# Altium schematic sheet JTAG.SchDoc
size Tabloid; SheetNumber: 7; SheetTotal: 25; Sheet_Name: JTAG; Size: 11x17
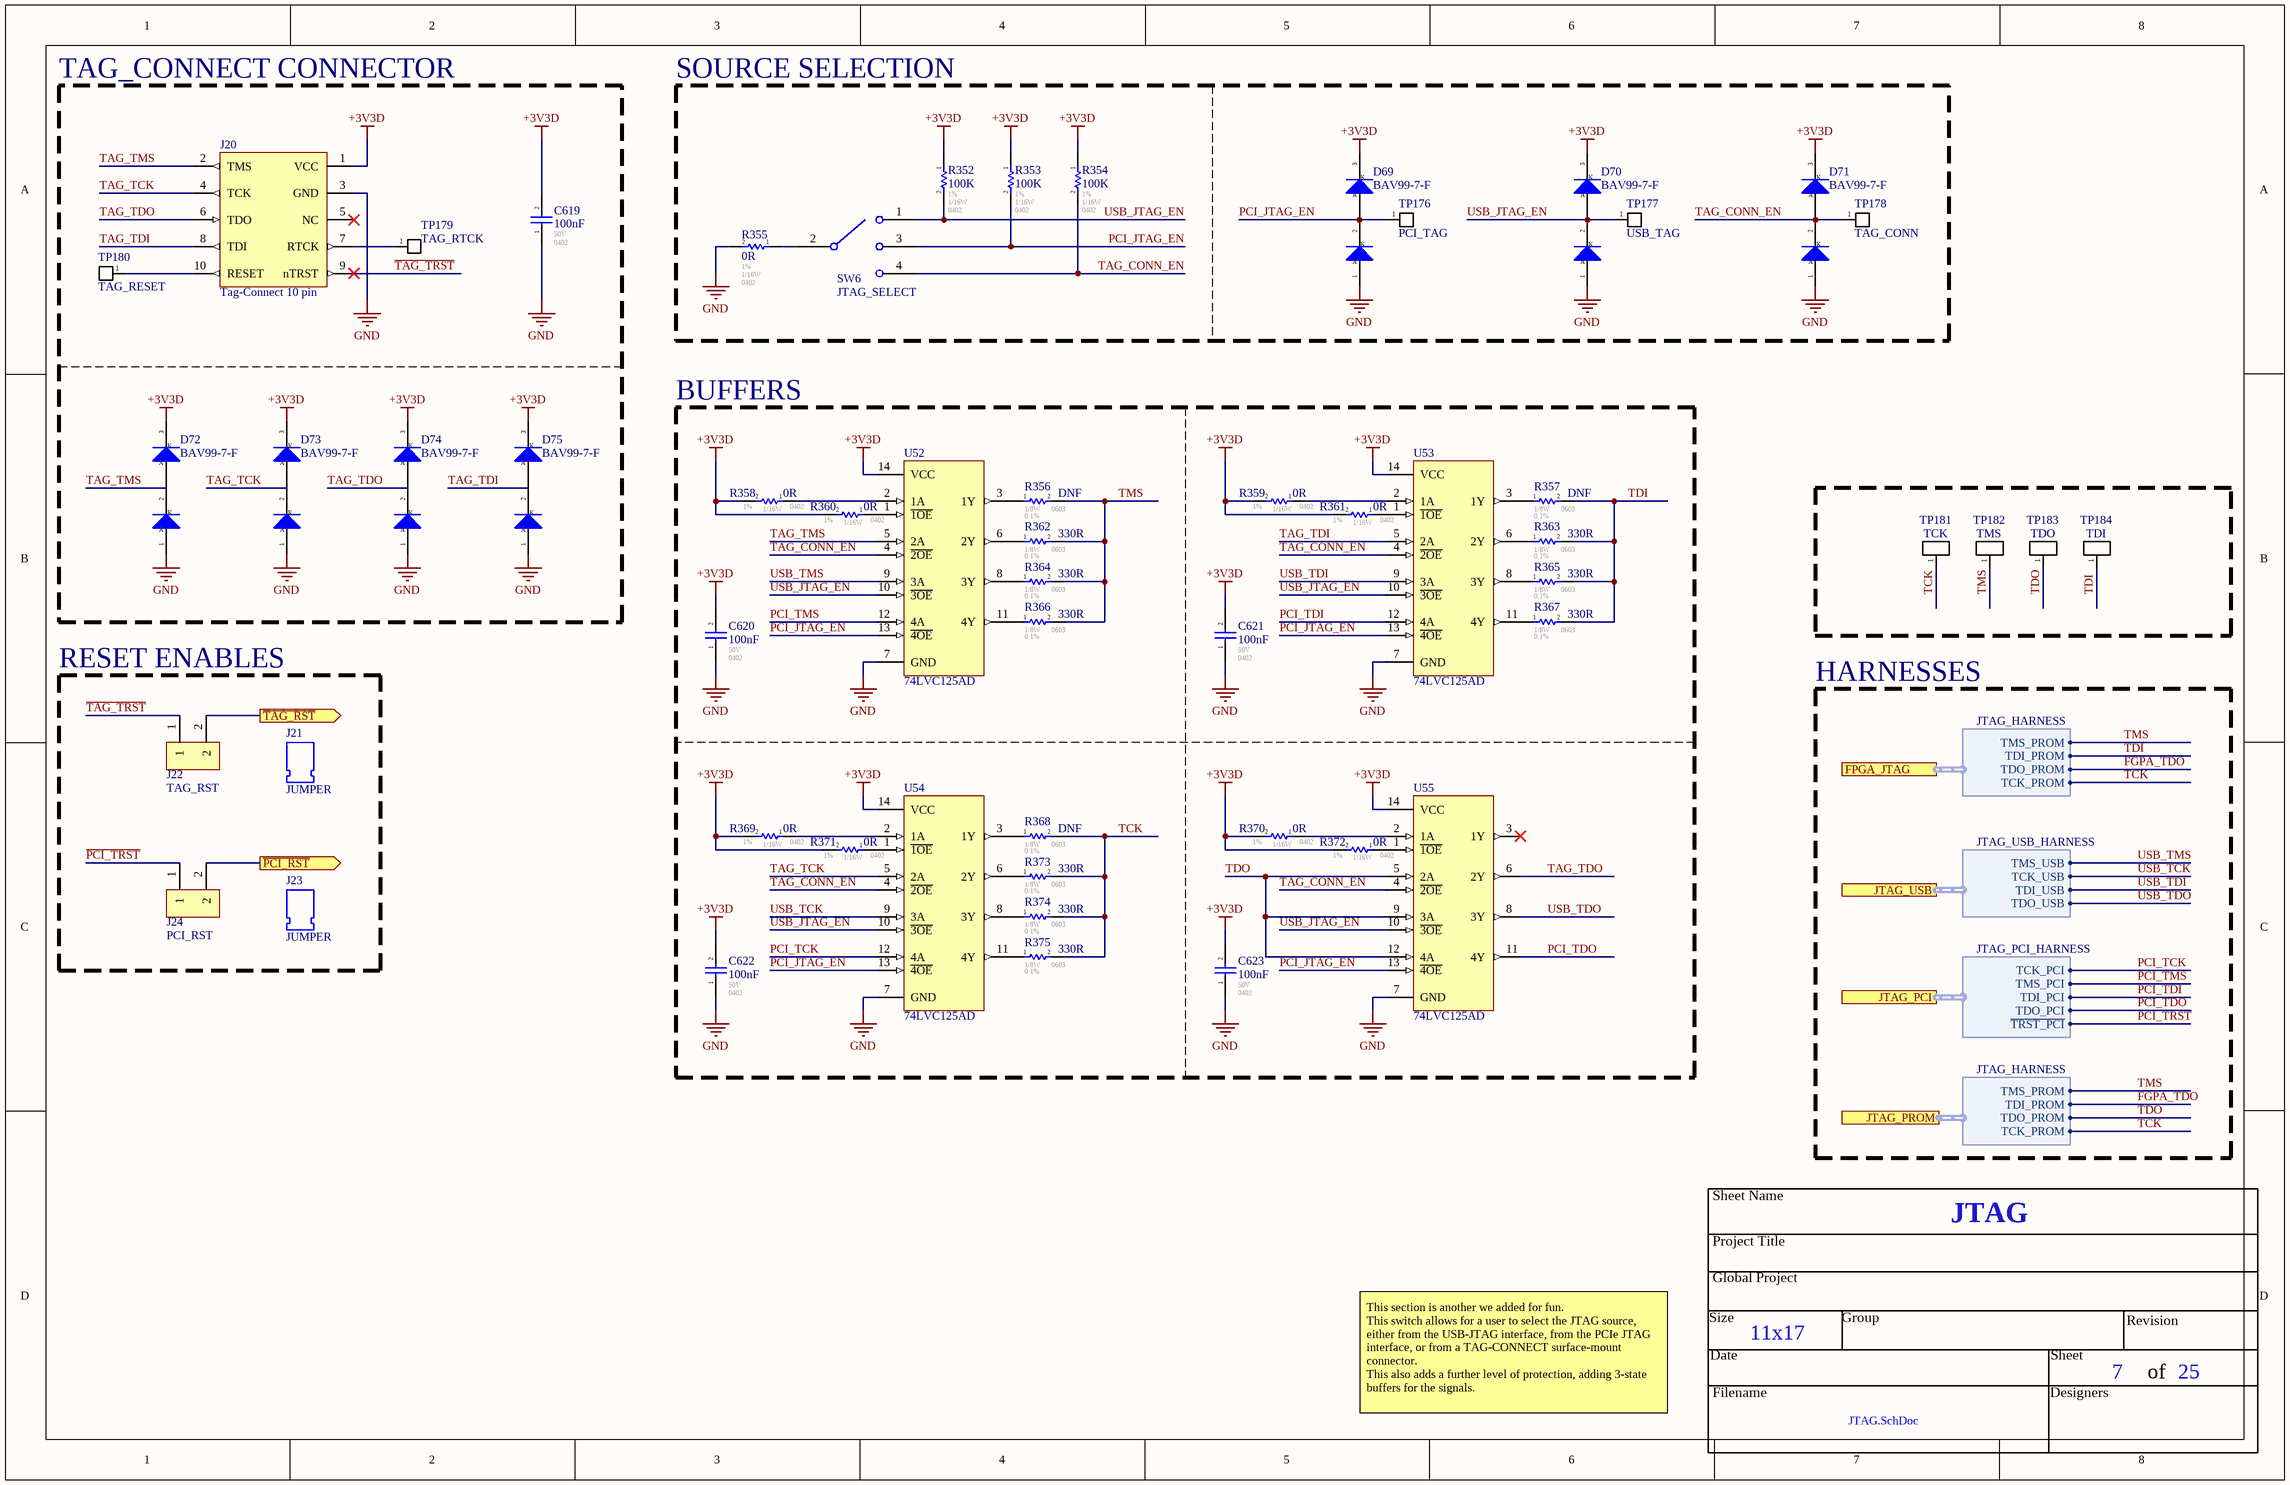
[diagram p0: JTAG.SchDoc]

## Parts
C619  100nF  Voltage - Rated: 50V  Footprint: 0402  [CAP_0402]
C620  100nF  Voltage - Rated: 50V  Footprint: 0402  [CAP_0402]
C621  100nF  Voltage - Rated: 50V  Footprint: 0402  [CAP_0402]
C622  100nF  Voltage - Rated: 50V  Footprint: 0402  [CAP_0402]
C623  100nF  Voltage - Rated: 50V  Footprint: 0402  [CAP_0402]
D69  BAV99-7-F  [SOT23-3]
D70  BAV99-7-F  [SOT23-3]
D71  BAV99-7-F  [SOT23-3]
D72  BAV99-7-F  [SOT23-3]
D73  BAV99-7-F  [SOT23-3]
D74  BAV99-7-F  [SOT23-3]
D75  BAV99-7-F  [SOT23-3]
J20  Tag-Connect 10 pin  [TC2050-NL]
J21  JUMPER  (mechanical)
J22  TAG_RST  [HEADER-2_100MIL]
J23  JUMPER  (mechanical)
J24  PCI_RST  [HEADER-2_100MIL]
R352  100K  Tolerance: 1%  Power: 1/16W  Package / Case: 0402  [RES_0402]
R353  100K  Tolerance: 1%  Power: 1/16W  Package / Case: 0402  [RES_0402]
R354  100K  Tolerance: 1%  Power: 1/16W  Package / Case: 0402  [RES_0402]
R355  0R  Tolerance: 1%  Power: 1/16W  Package / Case: 0402  [RES_0402]
R356  DNF  Tolerance: 0.1%  Power: 1/8W  Package / Case: 0603  [RES_0603]
R357  DNF  Tolerance: 0.1%  Power: 1/8W  Package / Case: 0603  [RES_0603]
R358  0R  Tolerance: 1%  Power: 1/16W  Package / Case: 0402  [RES_0402]
R359  0R  Tolerance: 1%  Power: 1/16W  Package / Case: 0402  [RES_0402]
R360  0R  Tolerance: 1%  Power: 1/16W  Package / Case: 0402  [RES_0402]
R361  0R  Tolerance: 1%  Power: 1/16W  Package / Case: 0402  [RES_0402]
R362  330R  Tolerance: 0.1%  Power: 1/8W  Package / Case: 0603  [RES_0603]
R363  330R  Tolerance: 0.1%  Power: 1/8W  Package / Case: 0603  [RES_0603]
R364  330R  Tolerance: 0.1%  Power: 1/8W  Package / Case: 0603  [RES_0603]
R365  330R  Tolerance: 0.1%  Power: 1/8W  Package / Case: 0603  [RES_0603]
R366  330R  Tolerance: 0.1%  Power: 1/8W  Package / Case: 0603  [RES_0603]
R367  330R  Tolerance: 0.1%  Power: 1/8W  Package / Case: 0603  [RES_0603]
R368  DNF  Tolerance: 0.1%  Power: 1/8W  Package / Case: 0603  [RES_0603]
R369  0R  Tolerance: 1%  Power: 1/16W  Package / Case: 0402  [RES_0402]
R370  0R  Tolerance: 1%  Power: 1/16W  Package / Case: 0402  [RES_0402]
R371  0R  Tolerance: 1%  Power: 1/16W  Package / Case: 0402  [RES_0402]
R372  0R  Tolerance: 1%  Power: 1/16W  Package / Case: 0402  [RES_0402]
R373  330R  Tolerance: 0.1%  Power: 1/8W  Package / Case: 0603  [RES_0603]
R374  330R  Tolerance: 0.1%  Power: 1/8W  Package / Case: 0603  [RES_0603]
R375  330R  Tolerance: 0.1%  Power: 1/8W  Package / Case: 0603  [RES_0603]
SW6  JTAG_SELECT  [1825256-6]
TP176  PCI_TAG  [TP_PAD]  (no BOM)
TP177  USB_TAG  [TP_PAD]  (no BOM)
TP178  TAG_CONN  [TP_PAD]  (no BOM)
TP179  TAG_RTCK  [TP_PAD]  (no BOM)
TP180  TAG_RESET  [TP_PAD]  (no BOM)
TP181  TCK  [TP_HOLE]  (no BOM)
TP182  TMS  [TP_HOLE]  (no BOM)
TP183  TDO  [TP_HOLE]  (no BOM)
TP184  TDI  [TP_HOLE]  (no BOM)
U52  74LVC125AD  [SOIC-14_3.8MM]
U53  74LVC125AD  [SOIC-14_3.8MM]
U54  74LVC125AD  [SOIC-14_3.8MM]
U55  74LVC125AD  [SOIC-14_3.8MM]

## Blocks framed on the sheet
TAG_CONNECT CONNECTOR: C619 D72-D75 J20 TP179 TP180
SOURCE SELECTION: D69-D71 R352-R355 SW6 TP176-TP178
BUFFERS: C620-C623 R356-R375 U52-U55
RESET ENABLES: J21-J24

## Ports
FPGA_JTAG (harness JTAG_HARNESS), JTAG_PCI (harness JTAG_PCI_HARNESS), JTAG_PROM (harness JTAG_HARNESS), JTAG_USB (harness JTAG_USB_HARNESS), ~{PCI_RST} (out), ~{TAG_RST} (out)

## Harnesses
JTAG_USB_HARNESS: TCK_USB, TDO_USB, TDI_USB, TMS_USB
JTAG_HARNESS: TCK_PROM, TDO_PROM, TDI_PROM, TMS_PROM
JTAG_PCI_HARNESS: TCK_PCI, TDO_PCI, TDI_PCI, TMS_PCI, ~{TRST_PCI}

## Nets
+3V3D: C619.2 C620.2 C621.2 C622.2 C623.2 D69.3(K) D70.3(K) D71.3(K) D72.3(K) D73.3(K) D74.3(K) D75.3(K) J20.1(VCC) R352.1 R353.1 R354.1 R358.2 R359.2 R360.2 R361.2 R369.2 R370.2 R371.2 R372.2 U52.14(VCC) U53.14(VCC) U54.14(VCC) U55.14(VCC)
GND: C619.1 C620.1 C621.1 C622.1 C623.1 D69.1(A) D70.1(A) D71.1(A) D72.1(A) D73.1(A) D74.1(A) D75.1(A) J20.3(GND) R355.2 U52.7(GND) U53.7(GND) U54.7(GND) U55.7(GND)
~{PCI_RST}: J24.2 ; port ~{PCI_RST}
~{PCI_TRST}: J24.1 ; port JTAG_PCI.~{TRST_PCI}
~{TAG_RST}: J22.2 ; port ~{TAG_RST}
~{TAG_TRST}: J20.9(nTRST) J22.1
FGPA_TDO: port JTAG_PROM.TDI_PROM, port FPGA_JTAG.TDO_PROM
PCI_JTAG_EN: D69.2(K) R353.2 SW6.3 TP176.1(A) U52.13(~{4OE}) U53.13(~{4OE}) U54.13(~{4OE}) U55.13(~{4OE})
PCI_TCK: U54.12(4A) ; port JTAG_PCI.TCK_PCI
PCI_TDI: U53.12(4A) ; port JTAG_PCI.TDI_PCI
PCI_TDO: U55.11(4Y) ; port JTAG_PCI.TDO_PCI
PCI_TMS: U52.12(4A) ; port JTAG_PCI.TMS_PCI
TAG_CONN_EN: D71.2(K) R354.2 SW6.4 TP178.1(A) U52.4(~{2OE}) U53.4(~{2OE}) U54.4(~{2OE}) U55.4(~{2OE})
TAG_TCK: D73.2(K) J20.4(TCK) U54.5(2A)
TAG_TDI: D75.2(K) J20.8(TDI) U53.5(2A)
TAG_TDO: D74.2(K) J20.6(TDO) U55.6(2Y)
TAG_TMS: D72.2(K) J20.2(TMS) U52.5(2A)
TCK: R368.2 R373.2 R374.2 R375.2 TP181.1(A) ; port JTAG_PROM.TCK_PROM, port FPGA_JTAG.TCK_PROM
TDI: R357.2 R363.2 R365.2 R367.2 TP184.1(A) ; port FPGA_JTAG.TDI_PROM
TDO: TP183.1(A) U55.5(2A) U55.9(3A) U55.12(4A) ; port JTAG_PROM.TDO_PROM
TMS: R356.2 R362.2 R364.2 R366.2 TP182.1(A) ; port JTAG_PROM.TMS_PROM, port FPGA_JTAG.TMS_PROM
USB_JTAG_EN: D70.2(K) R352.2 SW6.1 TP177.1(A) U52.10(~{3OE}) U53.10(~{3OE}) U54.10(~{3OE}) U55.10(~{3OE})
USB_TCK: U54.9(3A) ; port JTAG_USB.TCK_USB
USB_TDI: U53.9(3A) ; port JTAG_USB.TDI_USB
USB_TDO: U55.8(3Y) ; port JTAG_USB.TDO_USB
USB_TMS: U52.9(3A) ; port JTAG_USB.TMS_USB
NetJ20_7: J20.7(RTCK) TP179.1(A)
NetJ20_10: J20.10(RESET) TP180.1(A)
NetR355_1: R355.1 SW6.2
NetR356_1: R356.1 U52.3(1Y)
NetR357_1: R357.1 U53.3(1Y)
NetR358_1: R358.1 U52.2(1A)
NetR359_1: R359.1 U53.2(1A)
NetR360_1: R360.1 U52.1(~{1OE})
NetR361_1: R361.1 U53.1(~{1OE})
NetR362_1: R362.1 U52.6(2Y)
NetR363_1: R363.1 U53.6(2Y)
NetR364_1: R364.1 U52.8(3Y)
NetR365_1: R365.1 U53.8(3Y)
NetR366_1: R366.1 U52.11(4Y)
NetR367_1: R367.1 U53.11(4Y)
NetR368_1: R368.1 U54.3(1Y)
NetR369_1: R369.1 U54.2(1A)
NetR370_1: R370.1 U55.2(1A)
NetR371_1: R371.1 U54.1(~{1OE})
NetR372_1: R372.1 U55.1(~{1OE})
NetR373_1: R373.1 U54.6(2Y)
NetR374_1: R374.1 U54.8(3Y)
NetR375_1: R375.1 U54.11(4Y)

Not connected (* = marked no-connect by the designer): J20 5(NC)*; U55 3(1Y)*

## Notes on the sheet
- HARNESSES
- This section is another we added for fun.
  This switch allows for a user to select the JTAG source, either from the USB-JTAG interface, from the PCIe JTAG interface, or from a TAG-CONNECT surface-mount connector.
  This also adds a further level of protection, adding 3-state buffers for the signals.
- Sheet Name
- Project Title
- Global Project
- Revision
- Size
- Date
- Group
- Sheet
- of
- Filename
- Designers

## Library data of the parts
C619-C623 = CAP_CER: GCM155R71H104KE02J / 0402 100nF 10% X7R Ceramic Capacitor; Mfr: Murata; Operating Temperature: -55C - 125C; Temperature Coefficient: X7R; ComponentLink1Description: Digikey; ComponentLink1URL: [Digikey Link]; Part#: GCM155R71H104KE02J; ComponentLink2Description: Datasheet; ComponentLink2URL: [Datasheet Link]; Tolerance: 10%; Ratings: AEC-Q200
D69-D75 = DIODE_TVS_DUAL: Diode Array 1 Pair Series Connection 75 V 300mA (DC) Surface Mount TO-236-3, SC-59, SOT-23-3; Mfr: Diodes Incorporated; Voltage - DC Reverse: 75V; Voltage - Forward: 1.25V @ 150mA; Reverse Recovery Time: 4ns; Capacitance: 2pF; Current - Reverse Leakage: 2.5µA @ 75V; Operating Temperature: -65C - 150C; Package / Case: SOT-23-3; Current: 300mA; ComponentLink1Description: Digikey; ComponentLink1URL: https://www.digikey.ca/en/products/detail/diodes-incorporated/BAV99-7-F/815018; ComponentLink2Description: Datasheet; ComponentLink2URL: https://www.diodes.com/assets/Datasheets/BAV99.pdf; ComponentLink3Description: Octopart; ComponentLink3URL: https://octopart.com/bav99-7-f-diodes+inc.-326328; Supplier 1: Future Electronics; Supplier Part Number 1: 3851920
J20 = TC2050-NL
J22 J24 = HEADER_2
R352-R355 R358-R361 R369-R372 = RESISTOR: Automotive: AEC-Q200; Operating Temperature: *; # Digikey: *; ComponentLink1Description: Digikey; ComponentLink1URL: *; # Manufacturer: *
R356 R357 R362-R368 R373-R375 = RESISTOR: 1M 0603 1% 1/16W Resistor; Automotive: AEC-Q200; Operating Temperature: *; # Digikey: *; ComponentLink1Description: Digikey; ComponentLink1URL: *; # Manufacturer: *
SW6 = SP3T_SWITCH: 1825256-6 / Slide Switch SP3T Through Hole, Right Angle; Mfr: TE Connectivity; Switch Function: On-On-On; Current Rating: 400mA; Voltage Rating - AC: 20V; Cycles: 15000; Voltage Rating - DC: 20V; Operating Temperature: -20C - 85C
TP176-TP180 = TESTPOINT_PAD: Test Point
TP181-TP184 = TESTPOINT: Test Point; ClassName: Testpoint
U52-U55 = 74LVC125AD,118: Buffer, Non-Inverting 4 Element 1 Bit per Element 3-State Output 14-SO; Mfr: Nexperia; Number of Elements: 4; Voltage - Supply: 1.2V - 3.6V; Output Type: 3-state; Operating Temperature: -40C - 125C; ComponentLink1Description: Digikey; ComponentLink1URL: https://www.digikey.ca/en/products/detail/nexperia-usa-inc/74LVC125AD-118/946677; ComponentLink2Description: Datasheet; ComponentLink2URL: https://assets.nexperia.com/documents/data-sheet/74LVC125A.pdf; ComponentLink3Description: Mfr; ComponentLink3URL: https://www.nexperia.com/products/analog-logic-ics/logic/buffers-inverters-transceivers/buffers/74LVC125AD.html; ComponentLink4Description: Octopart; ComponentLink4URL: https://octopart.com/74lvc125ad%2C118-nexperia-78737785?r=sp